# EAGLE design destilador_pcb (EAGLE 9.2.2)
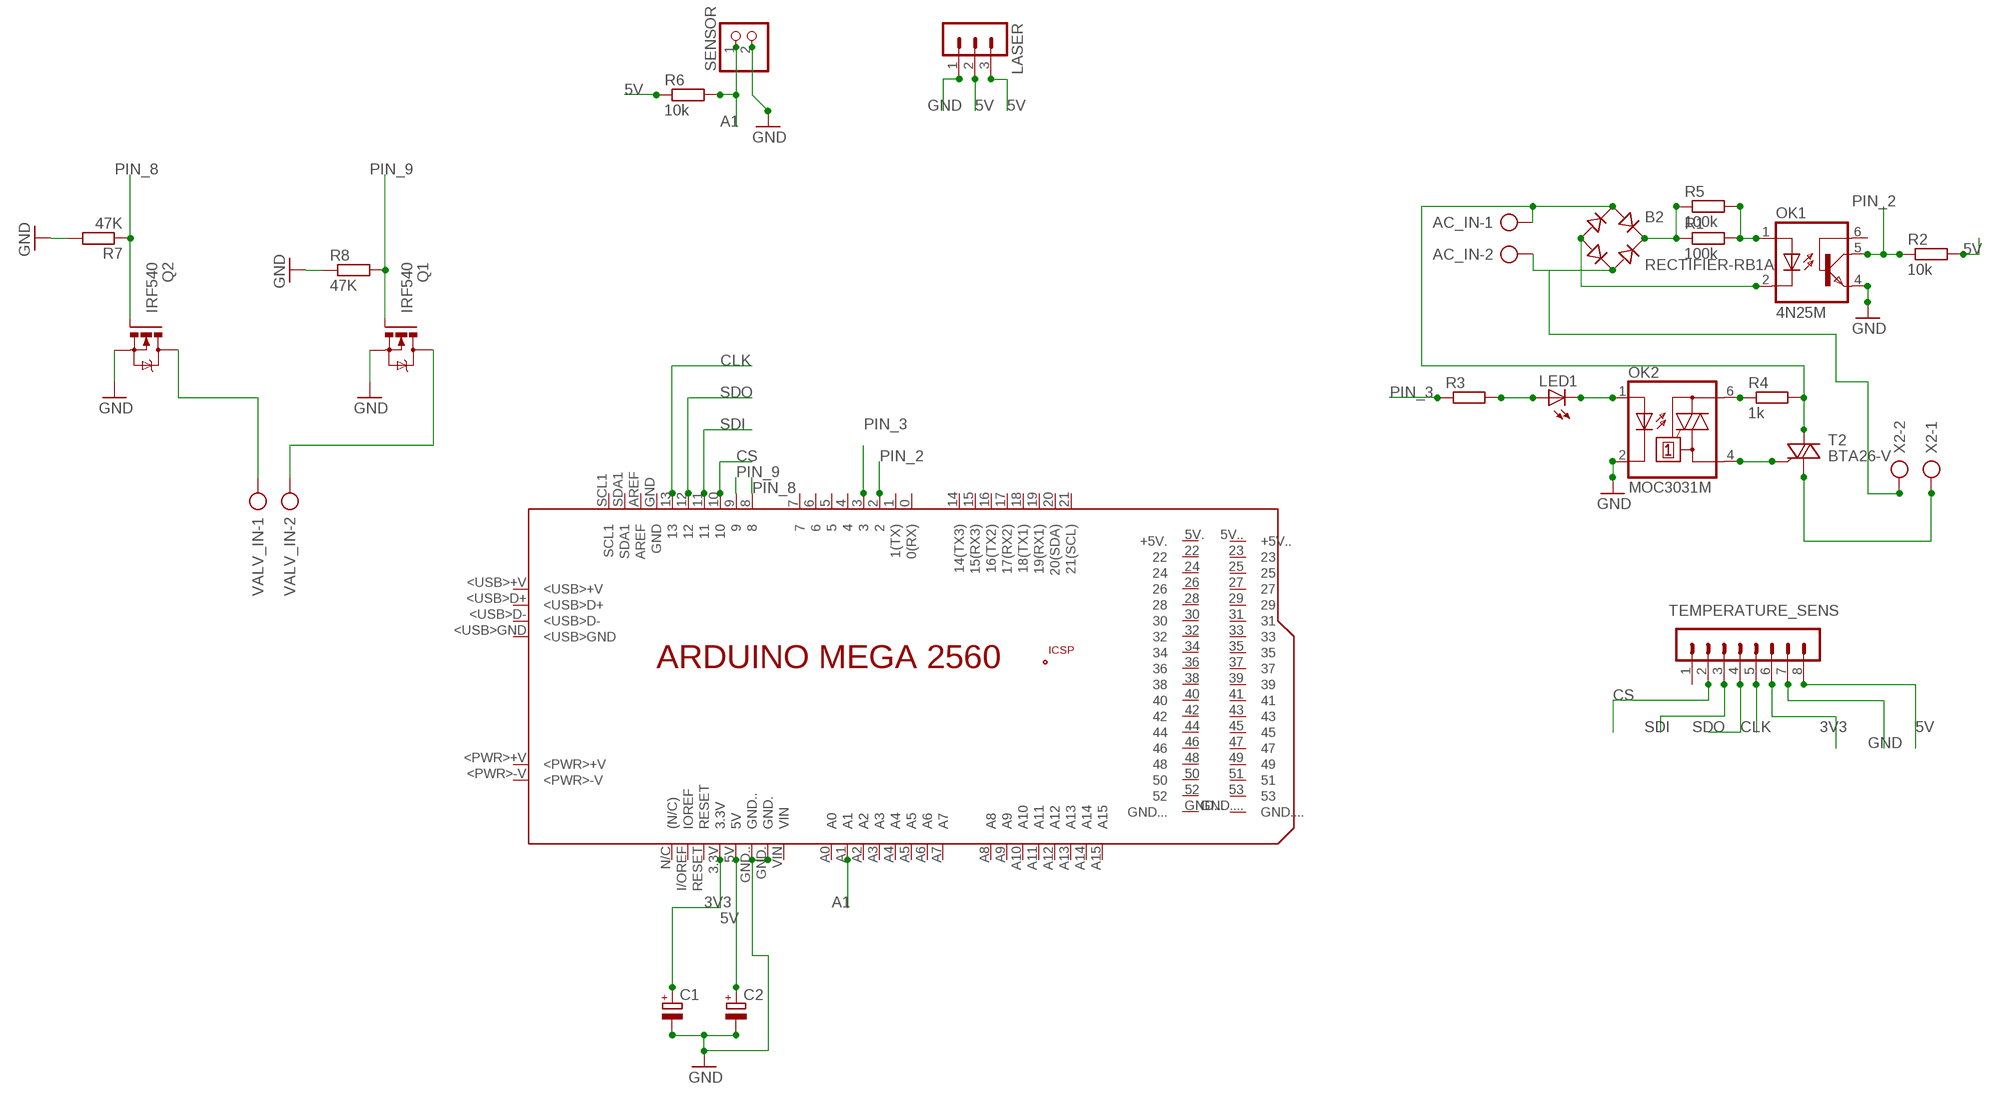
[diagram p0: schematic, sheet 1]

## Parts
AC_IN  AK300/2  [AK300/2]
B2  RECTIFIER-RB1A  [RB1A]
C1  CPOL-EUE2,5-6E  [E2,5-6E]
C2  CPOL-EUE2,5-6E  [E2,5-6E]
LASER  MA03-1  [MA03-1]
LED1  LED5MM  [LED5MM]
OK1  4N25M  [DIL06]
OK2  MOC3031M  [DIL06]
PCB1  ARDUINO_MEGA2560  [ARDUINO_MEGA2560]
Q1  IRF540  [TO220BV]
Q2  IRF540  [TO220BV]
R1  100k  R-EU_0207/7  [0207/7]
R2  10k  R-EU_0207/7  [0207/7]
R3  R-EU_0207/7  [0207/7]
R4  1k  R-EU_0207/7  [0207/7]
R5  100k  R-EU_0207/7  [0207/7]
R6  10k  R-EU_0207/7  [0207/7]
R7  47K  R-EU_0207/7  [0207/7]
R8  47K  R-EU_0207/7  [0207/7]
SENSOR  PINHD-1X2  [1X02]
T2  BTA26-V  [TOP3S-1]
TEMPERATURE_SENS  MA08-1  [MA08-1]
VALV_IN  AK500/2-H  [AK500/2-H]
X2  AK300/2  [AK300/2]

## Nets
3V3: C1.+ PCB1.3.3V TEMPERATURE_SENS.6
5V: C2.+ LASER.2 LASER.3 PCB1.5V R2.2 R6.1 TEMPERATURE_SENS.8
A1: PCB1.A1 R6.2 SENSOR.1
CLK: PCB1.13 TEMPERATURE_SENS.5
CS: PCB1.10 TEMPERATURE_SENS.2
GND: C1.- C2.- LASER.1 OK1.4(EMI) OK2.2(C) PCB1.GND. PCB1.GND.. Q1.S Q2.S R7.2 R8.1 SENSOR.2 TEMPERATURE_SENS.7
N$1: AC_IN.1 B2.AC1 R4.2 T2.A2
N$2: AC_IN.2 B2.AC2 X2.2
N$3: B2.- OK1.2(C)
N$4: B2.+ R1.1 R5.1
N$5: OK1.1(A) R1.2 R5.2
N$6: LED1.A R3.2
N$7: OK2.4(A1) T2.G
N$8: OK2.6(A2) R4.1
N$9: LED1.K(C) OK2.1(A)
N$10: T2.A1 X2.1
N$11: Q2.D VALV_IN.1
N$15: Q1.D VALV_IN.2
PIN_2: OK1.5(COL) PCB1.2 R2.1
PIN_3: PCB1.3 R3.1
PIN_8: PCB1.8 Q2.G R7.1
PIN_9: PCB1.9 Q1.G R8.2
SDI: PCB1.11 TEMPERATURE_SENS.3
SDO: PCB1.12 TEMPERATURE_SENS.4
Unconnected: OK1.6(BAS) PCB1.0(0(RX)) PCB1.1(1(TX)) PCB1.4 PCB1.5 PCB1.5V.(+5V.) PCB1.5V..(+5V..) PCB1.6 PCB1.7 PCB1.14(14(TX3)) PCB1.15(15(RX3)) PCB1.16(16(TX2)) PCB1.17(17(RX2)) PCB1.18(18(TX1)) PCB1.19(19(RX1)) PCB1.20(20(SDA)) PCB1.21(21(SCL)) PCB1.22 PCB1.23 PCB1.24 PCB1.25 PCB1.26 PCB1.27 PCB1.28 PCB1.29 PCB1.30 PCB1.31 PCB1.32 PCB1.33 PCB1.34 PCB1.35 PCB1.36 PCB1.37 PCB1.38 PCB1.39 PCB1.40 PCB1.41 PCB1.42 PCB1.43 PCB1.44 PCB1.45 PCB1.46 PCB1.47 PCB1.48 PCB1.49 PCB1.50 PCB1.51 PCB1.52 PCB1.53 PCB1.+5V_ PCB1.<PWR>+V PCB1.<PWR>-V PCB1.<USB>+V PCB1.<USB>D+ PCB1.<USB>D- PCB1.<USB>GND PCB1.A0 PCB1.A2 PCB1.A3 PCB1.A4 PCB1.A5 PCB1.A6 PCB1.A7 PCB1.A8 PCB1.A9 PCB1.A10 PCB1.A11 PCB1.A12 PCB1.A13 PCB1.A14 PCB1.A15 PCB1.AREF PCB1.GND PCB1.GND... PCB1.GND.... PCB1.GND__ PCB1.I/OREF(IOREF) PCB1.MISO PCB1.MOSI PCB1.N/C((N/C)) PCB1.RESET PCB1.RESET. PCB1.SCK PCB1.SCL1 PCB1.SDA1 PCB1.VIN TEMPERATURE_SENS.1

## Library data of the parts
AC_IN X2 = con-ptr500:AK300/2: CONNECTOR; OC_FARNELL: unknown; OC_NEWARK: unknown
B2 = rectifier:RECTIFIER-: Rectifier
C1 C2 = rcl:CPOL-EU: POLARIZED CAPACITOR, European symbol
LASER = con-lstb:MA03-1: PIN HEADER; OC_FARNELL: unknown; OC_NEWARK: unknown
LED1 = led:LED: LED OSRAM: - CHIPLED LG R971, LG N971, LY N971, LG Q971, LY Q971, LO R971, LY R971 LH N974, LH R974 LS Q976, LO Q976, LY Q976 LO Q996 - Hyper CHIPLED LW Q18S LB Q993, LB Q99A, LB R99A - SideLED LS A670, LO A670, LY A670, LG A670, LP A670 LB A673, LV A673, LT A673, LW A673 LH A674 LY A675 LS A676, LA A676, LO A676, LY A676, LW A676 LS A679, LY A679, LG A679 - Hyper Micro SIDELED® LS Y876, LA Y876, LO Y876, LY Y876 LT Y87S - SmartLED LW L88C, LW L88S LB L89C, LB L89S, LG L890 LS L89K, LO L89K, LY L89K LS L896, LA L896, LO L896, LY L896 - TOPLED LS T670, LO T670, LY T670, LG T670, LP T670 LSG T670, LSP T670, LSY T670, LOP T670, LYG T670 LG T671, LOG T671, LSG T671 LB T673, LV T673, LT T673, LW T673 LH T674 LS T676, LA T676, LO T676, LY T676, LB T676, LH T676, LSB T676, LW T676 LB T67C, LV T67C, LT T67C, LS T67K, LO T67K, LY T67K, LW E67C LS E67B, LA E67B, LO E67B, LY E67B, LB E67C, LV E67C, LT E67C LW T67C LS T679, LY T679, LG T679 LS T770, LO T770, LY T770, LG T770, LP T770 LB T773, LV T773, LT T773, LW T773 LH T774 LS E675, LA E675, LY E675, LS T675 LS T776, LA T776, LO T776, LY T776, LB T776 LHGB T686 LT T68C, LB T68C - Hyper Mini TOPLED® LB M676 - Mini TOPLED Santana® LG M470 LS M47K, LO M47K, LY M47K Source: http://www.osram.convergy.de LUXEON: - LUMILED® LXK2-PW12-R00, LXK2-PW12-S00, LXK2-PW14-U00, LXK2-PW14-V00 LXK2-PM12-R00, LXK2-PM12-S00, LXK2-PM14-U00 LXK2-PE12-Q00, LXK2-PE12-R00, LXK2-PE12-S00, LXK2-PE14-T00, LXK2-PE14-U00 LXK2-PB12-K00, LXK2-PB12-L00, LXK2-PB12-M00, LXK2-PB14-N00, LXK2-PB14-P00, LXK2-PB14-Q00 LXK2-PR12-L00, LXK2-PR12-M00, LXK2-PR14-Q00, LXK2-PR14-R00 LXK2-PD12-Q00, LXK2-PD12-R00, LXK2-PD12-S00 LXK2-PH12-R00, LXK2-PH12-S00 LXK2-PL12-P00, LXK2-PL12-Q00, LXK2-PL12-R00 Source: www.luxeon.com KINGBRIGHT: KA-3528ASYC Source: www.kingbright.com
OK1 = optocoupler:4N*?M: General Purpose 6-Pin Phototransistor Optocouplers Source: http://www.fairchildsemi.com/ds/4N/4N35-M.pdf; MPN: 4N25-M; OC_FARNELL: 1021349; OC_NEWARK: 98K9084
OK2 = optocoupler:MOC30*: 6-Pin DIP Zero-Cross Optoisolators Triac Driver Output (250/400 Volt Peak) Source: Data sheet <http://www.fairchildsemi.com/ds/MO/MOC3031M.pdf> The old path of data sheet not more available 2013-05-06.; MF: FAIRCHILD SEMICONDUCTOR; MPN: MOC3031M; OC_FARNELL: 9875964; OC_NEWARK: 78K6089
PCB1 = E14_Arduino_revB:ARDUINO_MEGA2560: Device for representing an Arduino Mega 2560 board with a footprint in an EAGLE design. Created by Dave Young for Element14. More EAGLE documentation at: http://www.element14.com/community/community/knode/cadsoft_eagle
Q1 Q2 = transistor-power:IRF540: HEXFET Power MOSFET
R1-R8 = resistor:R-EU_: RESISTOR, European symbol
SENSOR = pinhead:PINHD-1X2: PIN HEADER
T2 = triac:BTA26: 25A TRIAC Source: http://www.st.com/stonline/products/literature/ds/7470.pdf
TEMPERATURE_SENS = con-lstb:MA08-1: PIN HEADER; OC_FARNELL: unknown; OC_NEWARK: unknown
VALV_IN = con-ptr500:AK500/2-H: CONNECTOR Aug. 2004 / PTR Meßtechnik: Die Bezeichnung der Serie AK505 wurde geändert. Es handelt sich hierbei um AK500 in horizontaler Ausführung.; OC_FARNELL: unknown; OC_NEWARK: unknown

## Board
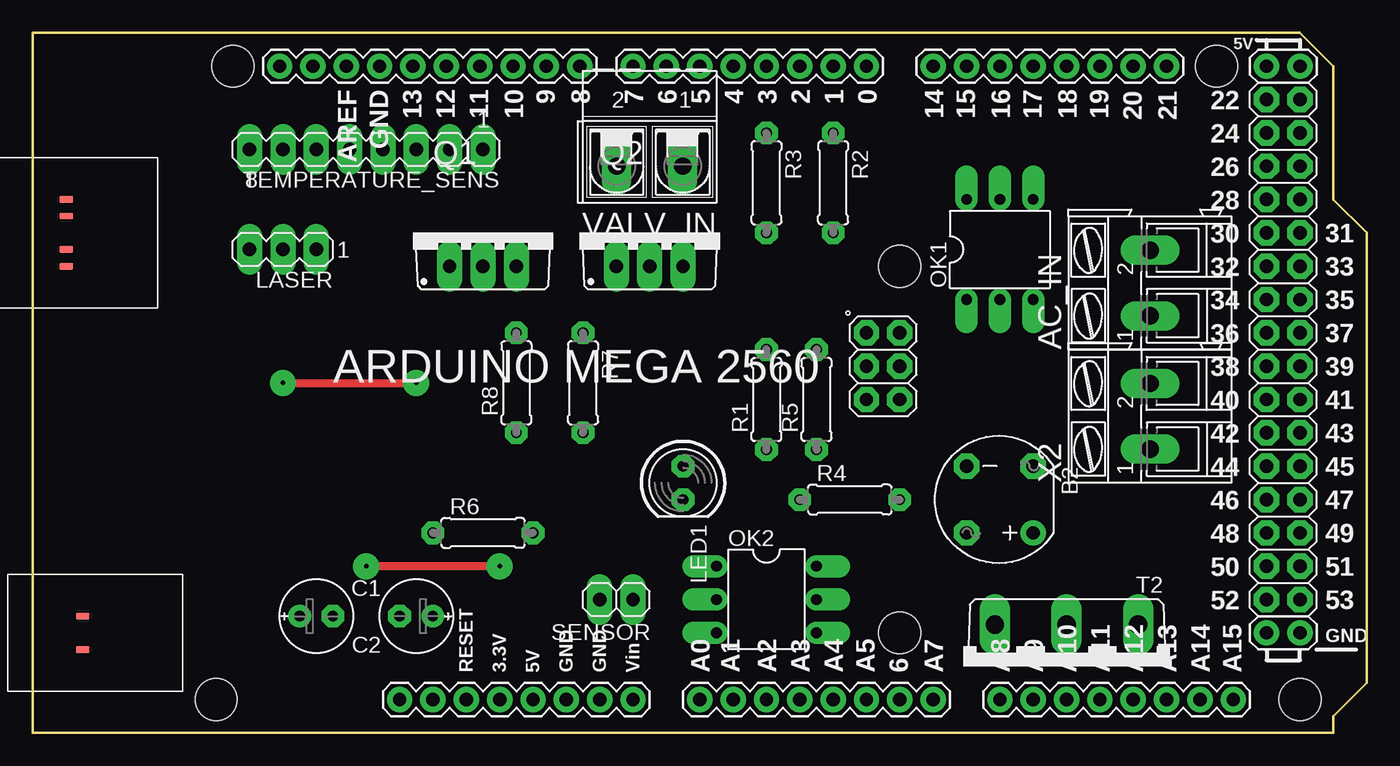
[diagram p1: board, top side]
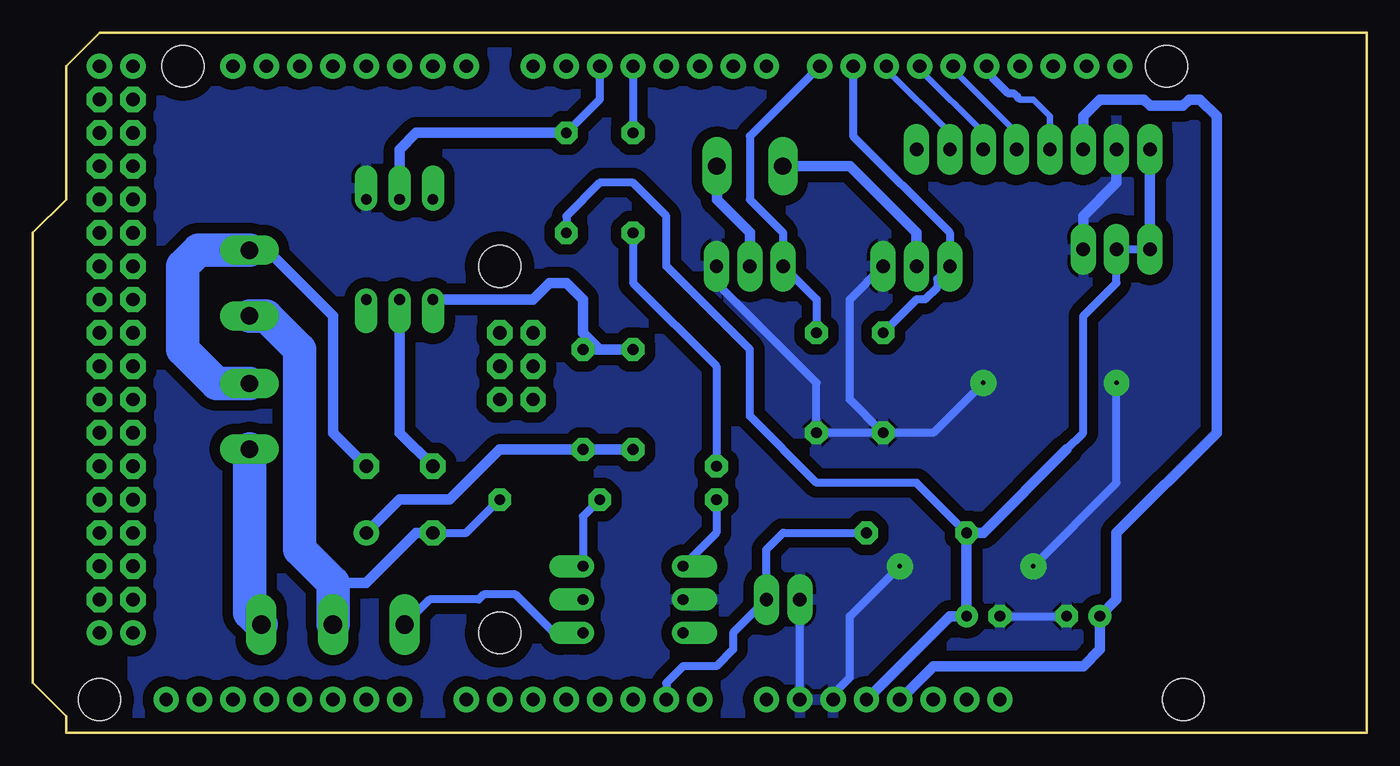
[diagram p2: board, bottom side, seen from below]

Size 101.6 x 53.34 mm. Coordinates in mm from the lower left corner, seen from the top.
Copper layers (1*16): Top 0.035mm / dielectric 1.5mm / Bottom 0.035mm
Design rules "default *": minimum track width 12mil, minimum drill 0.35mm, track to track 32mil, track to pad 32mil, pad to pad 6mil, via to via 6mil, smd to smd 6mil, copper to edge 40mil, drill to drill 6mil, minimum pad ring 18mil, minimum via ring 32mil, stop-mask expansion 4mil, vias tented up to drill 0mil, thermal gap 10mil

### Footprints (pad centres in the part's own frame; a part is rotated, then mirrored left to right if it is on the bottom)
AK300/2 = drill 1.321 long: 1 -2.515,0; 2 2.489,0
RB1A = drill 1.016: + -2.54,2.54 | drill 1.016 octagon: - 2.54,-2.54; AC1 2.54,2.54; AC2 -2.54,-2.54
E2,5-6E = drill 0.813 pad 1.575: + -1.27,0 | drill 0.813 pad 1.575 octagon: - 1.27,0
MA03-1 = drill 1.016 long: 1 -2.54,0; 2 0,0; 3 2.54,0
LED5MM = drill 0.813 octagon: A -1.27,0; K 1.27,0
DIL06 = drill 0.813 offset: 1 -2.54,-3.81; 2 0,-3.81; 3 2.54,-3.81; 4 2.54,3.81; 5 0,3.81; 6 -2.54,3.81
ARDUINO_MEGA2560 = drill 1.016 pad 1.88: 0 63.5,50.8; 1 60.96,50.8; 2 58.42,50.8; 3 55.88,50.8; 3.3V 35.56,2.54; 4 53.34,50.8; 5 50.8,50.8; 5V 38.1,2.54; 5V. 93.98,50.8; 5V.. 96.52,50.8; 6 48.26,50.8; 7 45.72,50.8; 8 41.656,50.8; 9 39.116,50.8; 10 36.576,50.8; 11 34.036,50.8; 12 31.496,50.8; 13 28.956,50.8; 14 68.58,50.8; 15 71.12,50.8; 16 73.66,50.8; 17 76.2,50.8; 18 78.74,50.8; 19 81.28,50.8; 20 83.82,50.8; 21 86.36,50.8; A0 50.8,2.54; A1 53.34,2.54; A2 55.88,2.54; A3 58.42,2.54; A4 60.96,2.54; A5 63.5,2.54; A6 66.04,2.54; A7 68.58,2.54; A8 73.66,2.54; A9 76.2,2.54; A10 78.74,2.54; A11 81.28,2.54; A12 83.82,2.54; A13 86.36,2.54; A14 88.9,2.54; A15 91.44,2.54; AREF 23.876,50.8; GND 26.416,50.8; GND. 43.18,2.54; GND.. 40.64,2.54; GND... 93.98,7.62; GND.... 96.52,7.62; I/OREF 30.48,2.54; N/C 27.94,2.54; RESET 33.02,2.54; SCL1 18.796,50.8; SDA1 21.336,50.8; VIN 45.72,2.54 | drill 1.016 pad 1.88 octagon: 22 93.98,48.26; 23 96.52,48.26; 24 93.98,45.72; 25 96.52,45.72; 26 93.98,43.18; 27 96.52,43.18; 28 93.98,40.64; 29 96.52,40.64; 30 93.98,38.1; 31 96.52,38.1; 32 93.98,35.56; 33 96.52,35.56; 34 93.98,33.02; 35 96.52,33.02; 36 93.98,30.48; 37 96.52,30.48; 38 93.98,27.94; 39 96.52,27.94; 40 93.98,25.4; 41 96.52,25.4; 42 93.98,22.86; 43 96.52,22.86; 44 93.98,20.32; 45 96.52,20.32; 46 93.98,17.78; 47 96.52,17.78; 48 93.98,15.24; 49 96.52,15.24; 50 93.98,12.7; 51 96.52,12.7; 52 93.98,10.16; 53 96.52,10.16; +5V_ 66.04,30.48; GND__ 66.04,25.4; MISO 63.5,30.48; MOSI 66.04,27.94; RESET. 63.5,25.4; SCK 63.5,27.94 | smd 1.016 x 0.508: <PWR>+V 3.81,8.89; <PWR>-V 3.81,6.35; <USB>+V 2.54,40.64; <USB>D+ 2.54,39.37; <USB>D- 2.54,36.83; <USB>GND 2.54,35.56 | hole 3.2: 15.24,50.8; 13.97,2.54; 66.04,35.56; 66.04,7.62; 90.17,50.8; 96.52,2.54
TO220BV = drill 1.016 long: D 0,-2.54; G -2.54,-2.54; S 2.54,-2.54
0207/7 = drill 0.813 octagon: 1 -3.81,0; 2 3.81,0
1X02 = drill 1.016 long: 1 -1.27,0; 2 1.27,0
TOP3S-1 = drill 1.397 long: A1 -5.461,-3.175; A2 0,-3.175; G 5.461,-3.175
MA08-1 = drill 1.016 long: 1 -8.89,0; 2 -6.35,0; 3 -3.81,0; 4 -1.27,0; 5 1.27,0; 6 3.81,0; 7 6.35,0; 8 8.89,0
AK500/2-H = drill 1.321 long: 1 -2.515,0; 2 2.515,0

### Placement (x,y rotation side)
AC_IN  85.09,34.29 90 top
B2  73.66,17.78 180 top
C1  21.59,8.89 0 top
C2  29.21,8.89 180 top
LASER  19.05,36.83 180 top
LED1  49.53,19.05 270 top
OK1  73.66,36.83 0 top
OK2  55.88,10.16 270 top
PCB1  0,0 0 top
Q1  34.29,38.1 0 top
Q2  46.99,38.1 0 top
R1  55.88,25.4 90 top
R2  60.96,41.91 270 top
R3  55.88,41.91 270 top
R4  62.23,17.78 0 top
R5  59.69,25.4 90 top
R6  34.29,15.24 0 top
R7  41.91,26.67 270 top
R8  36.83,26.67 90 top
SENSOR  44.45,10.16 180 top
T2  78.74,5.08 180 top
TEMPERATURE_SENS  25.4,44.45 180 top
VALV_IN  46.99,43.18 180 top
X2  85.09,24.13 90 top

### Tracks (layer width: path | path; a pad name or v marks a point on that pad's centre or on a via)
3V3
  Bottom 0.813: PCB1.3.3V 33.02,5.08 21.59,5.08 20.32,6.35 C1.+ 19.05,10.16 19.05,15.24 11.43,22.86 11.43,46.99 12.7,48.26 13.51,48.26 13.99,47.78 16.49,47.78 16.97,48.26 20.32,48.26 21.59,46.99 TEMPERATURE_SENS.6
5V
  Bottom 0.61: R6.1 34.29,19.05 41.91,19.05 46.99,24.13 46.99,29.21 53.34,35.56 53.34,39.37 55.88,41.91 58.42,41.91 60.96,39.37 R2.2 | LASER.3 LASER.2 19.05,34.29 21.59,31.75 21.59,22.86 22.86,21.59
  Bottom 0.813: PCB1.5V 31.75,8.89 C2.+ R6.1 29.21,15.24 22.86,21.59 | TEMPERATURE_SENS.8 LASER.3
A1
  Bottom 0.61: R6.2 44.45,15.24 45.72,13.97 SENSOR.1 48.26,7.62 48.26,6.35 49.53,5.08 52.07,5.08 53.34,3.81 PCB1.A1
CLK
  Bottom 0.508: 26.54,48.39 26.42,48.26 25.4,48.26 24.13,46.99 TEMPERATURE_SENS.5
  Bottom 0.61: 26.54,48.39 26.87,48.72 27.28,48.72 28.5,49.94 28.5,50.34 PCB1.13
CS
  Bottom 0.508: TEMPERATURE_SENS.2 31.75,45.72 36.58,50.55 PCB1.10
GND  (via drill 0.35 pad 0.95)
  Top 0.61: v35.56,12.7 v25.4,12.7 | v19.05,26.67 v29.21,26.67
  Bottom 0.61: PCB1.GND. SENSOR.2 | R8.1 R7.2 41.91,26.67 49.53,34.29 Q2.S | R8.1 39.37,25.4 39.37,33.02 Q1.S | C2.- C1.- | PCB1.GND.. 40.18,3 40.18,3.4 39.37,4.22 39.37,8.89 v35.56,12.7 | v25.4,12.7 19.05,19.05 v19.05,26.67 | v29.21,26.67 33.02,22.86 R8.1
  Bottom 0.813: LASER.1 21.59,39.37 19.05,41.91 TEMPERATURE_SENS.7
  pour Bottom: 0,0 0,53.34 92.71,53.34 93.98,52.07 93.98,1.27 92.71,0
N$1
  Bottom 0.61: 77.47,11.43 78.74,11.43 | B2.AC1 68.58,15.24 R4.2
  Bottom 0.813: B2.AC1 72.39,15.24 76.2,11.43 77.47,11.43
  Bottom 2.54: T2.A2 78.74,11.43 81.28,13.97 81.28,29.21 83.84,31.78 AC_IN.1
N$2
  Bottom 0.813: B2.AC2 78.74,22.86 78.74,31.75 83.77,36.78 AC_IN.2
  Bottom 2.54: AC_IN.2 88.95,36.78 90.17,35.56 90.17,29.21 87.58,26.62 X2.2
N$3
  Bottom 0.813: OK1.2 73.66,22.86 B2.-
N$4
  Bottom 0.813: B2.+ 73.66,17.78 69.85,17.78 66.04,21.59 R5.1 R1.1
N$5
  Bottom 0.813: R1.2 58.42,29.21 | 58.42,29.21 R5.2 | 58.42,29.21 59.69,30.48 59.69,33.02 60.96,34.29 62.23,34.29 63.5,33.02 OK1.1
N$6
  Bottom 0.61: R3.2 55.88,34.29 49.53,27.94 LED1.A
N$7
  Bottom 0.61: OK2.4 61.91,7.62 64.83,10.54 67.25,10.54 67.63,10.16 71.37,10.16 T2.G
N$8
  Bottom 0.61: R4.1 59.69,16.51 OK2.6
N$9
  Bottom 0.61: LED1.K 49.53,15.24 OK2.1
N$10
  Bottom 2.54: X2.1 85.09,9.14 T2.A1
N$11
  Bottom 0.813: Q2.D 46.99,38.1 49.5,40.61 VALV_IN.1
N$15
  Bottom 0.813: VALV_IN.2 39.37,43.18 34.29,38.1 Q1.D
PIN_2
  Bottom 0.61: PCB1.2 58.42,48.26 R2.1
  Bottom 0.813: OK1.5 73.66,44.45 72.39,45.72 R2.1
PIN_3
  Bottom 0.61: PCB1.3 R3.1
PIN_8
  Bottom 0.61: R7.1 41.91,33.02 Q2.G 44.45,38.1 46.99,40.64 46.99,45.47 PCB1.8 41.91,50.55
PIN_9
  Bottom 0.61: R8.2 34.29,33.02 33.64,33.02 32.71,33.94 32.71,34.59 Q1.G 31.75,38.1 39.12,45.47 PCB1.9
SDI
  Bottom 0.508: TEMPERATURE_SENS.3 29.21,45.72 34.04,50.55 PCB1.11
SDO
  Bottom 0.508: TEMPERATURE_SENS.4 26.67,45.72 31.5,50.55 PCB1.12